# Altium schematic sheet LED fix910 RD 2000278 (4F00223A_7P00493A)_1.SchDoc
size 900 x 281 mm
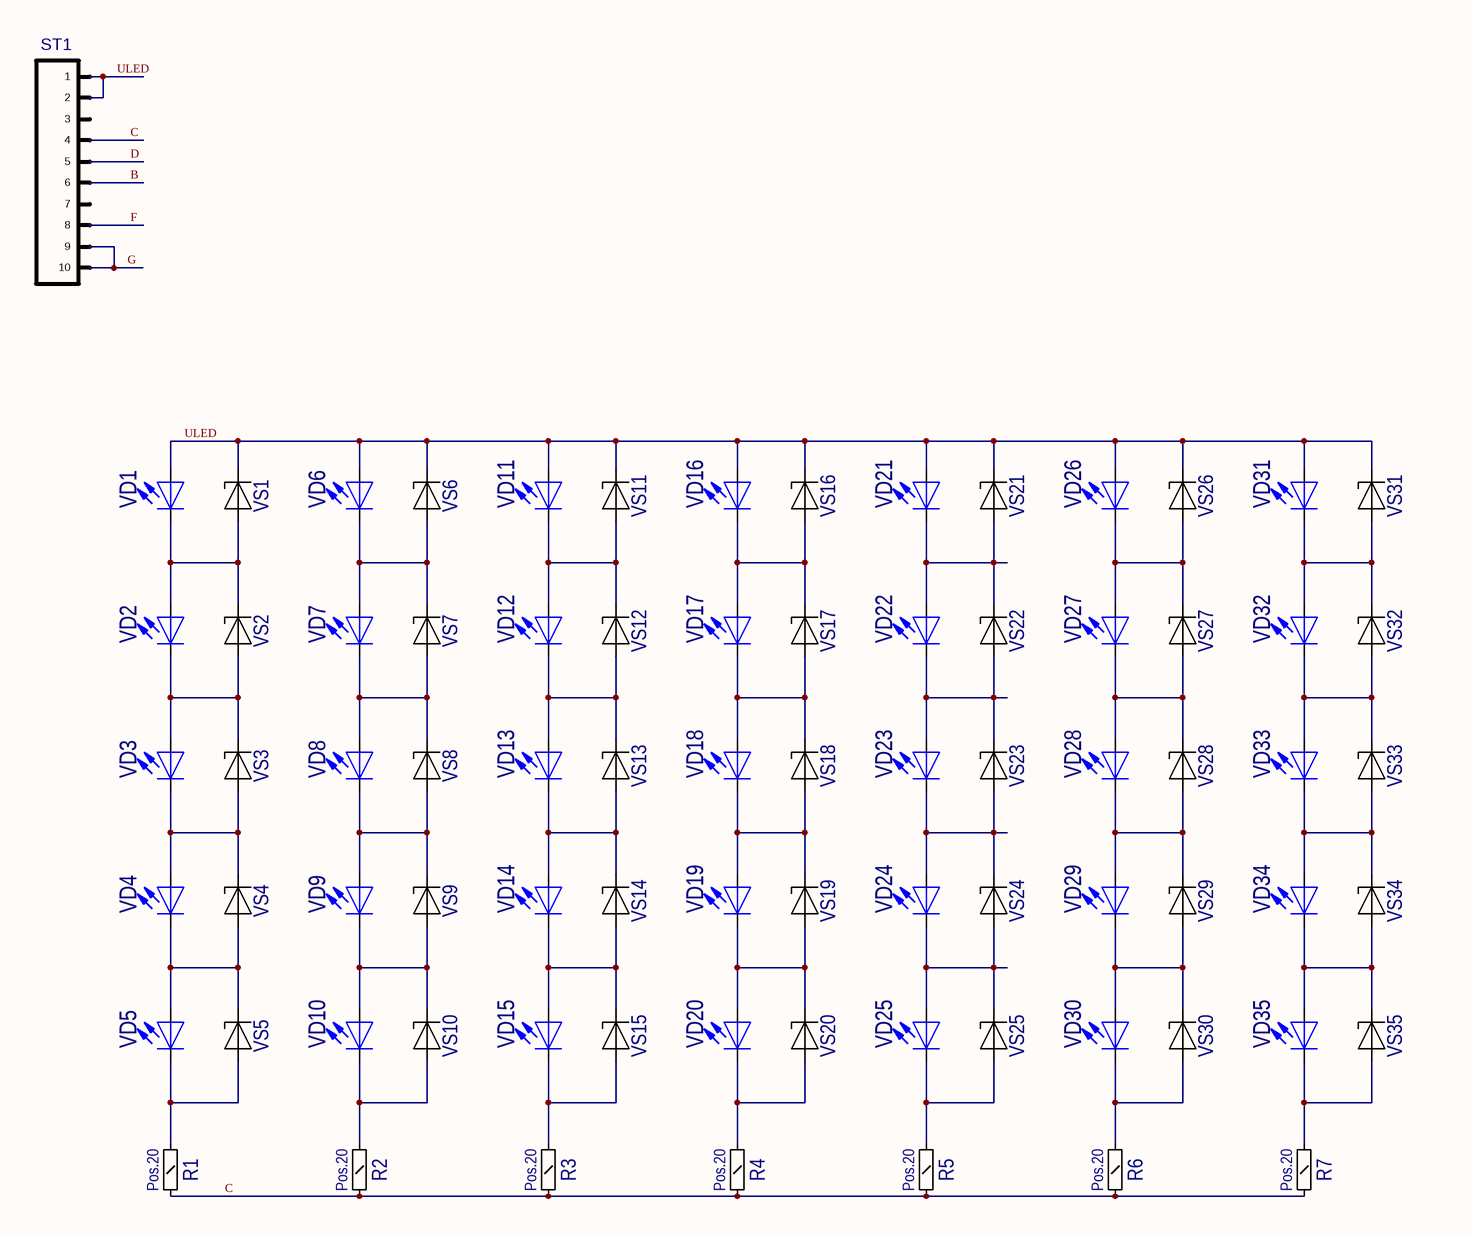
[diagram p0: LED fix910 RD 2000278 (4F00223A_7P00493A)_1.SchDoc, left]
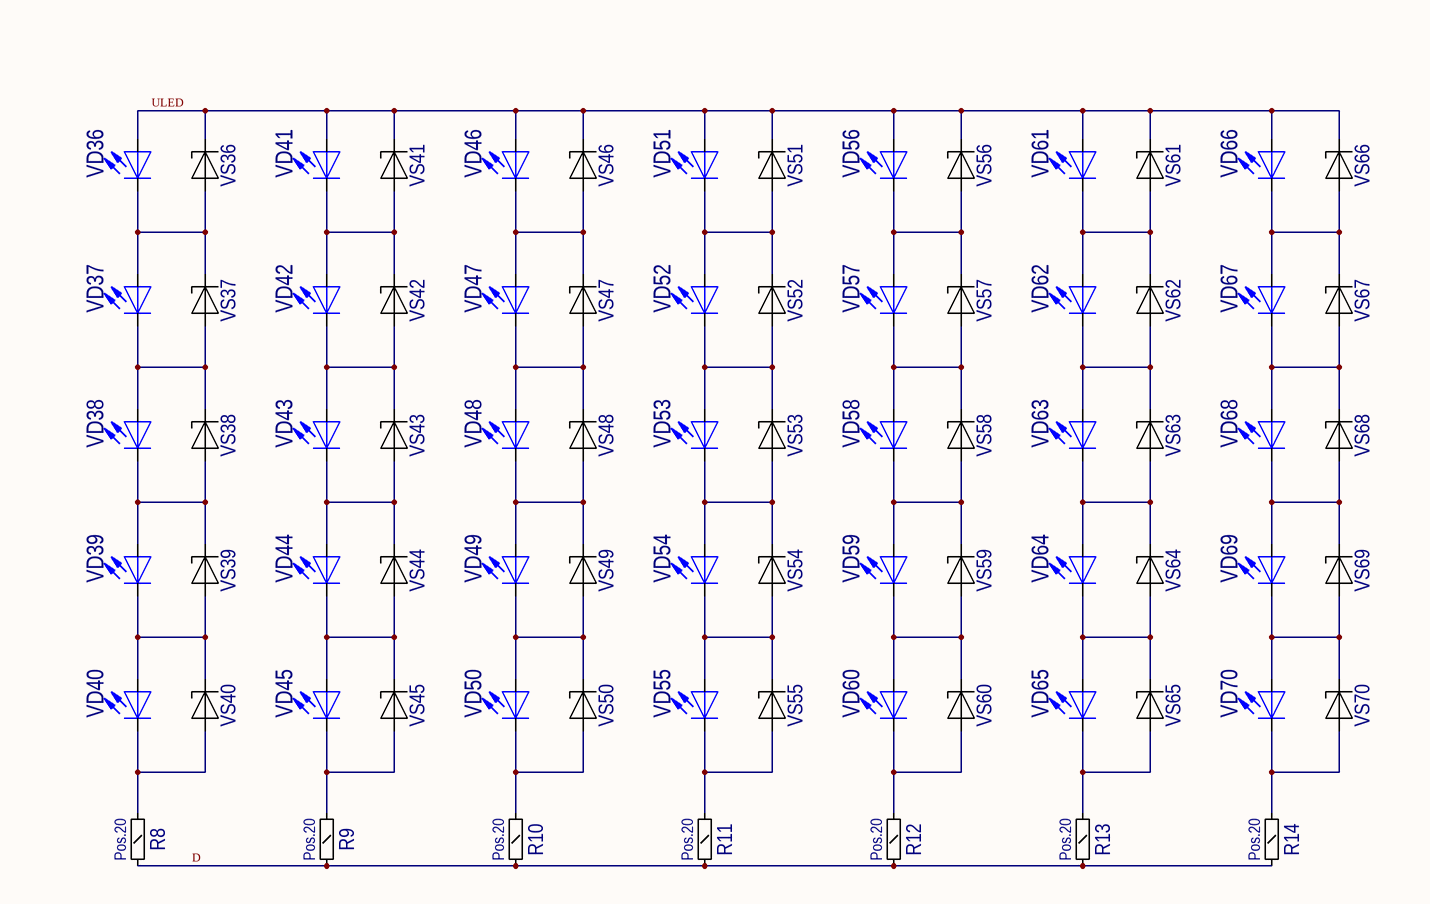
[diagram p1: LED fix910 RD 2000278 (4F00223A_7P00493A)_1.SchDoc, middle]
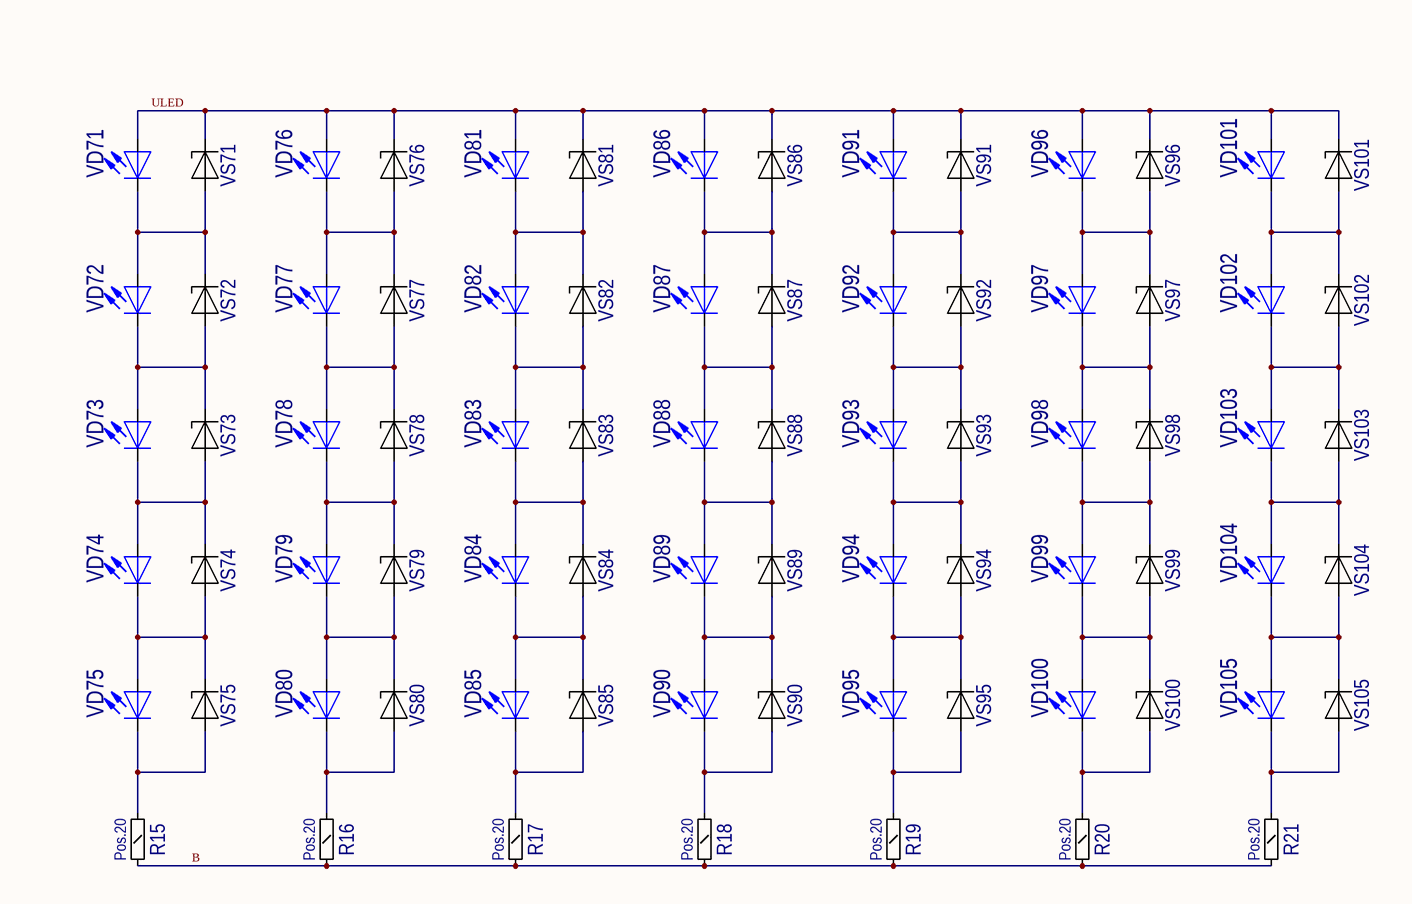
[diagram p2: LED fix910 RD 2000278 (4F00223A_7P00493A)_1.SchDoc, right]

## Parts
R1  value Pos.20  [RC1206S]  (hidden comment: R1206S)
R2  value Pos.20  [RC1206S]  (hidden comment: R1206S)
R3  value Pos.20  [RC1206S]  (hidden comment: R1206S)
R4  value Pos.20  [RC1206S]  (hidden comment: R1206S)
R5  value Pos.20  [RC1206S]  (hidden comment: R1206S)
R6  value Pos.20  [RC1206S]  (hidden comment: R1206S)
R7  value Pos.20  [RC1206S]  (hidden comment: R1206S)
R8  value Pos.20  [RC1206S]  (hidden comment: R1206S)
R9  value Pos.20  [RC1206S]  (hidden comment: R1206S)
R10  value Pos.20  [RC1206S]  (hidden comment: R1206S)
R11  value Pos.20  [RC1206S]  (hidden comment: R1206S)
R12  value Pos.20  [RC1206S]  (hidden comment: R1206S)
R13  value Pos.20  [RC1206S]  (hidden comment: R1206S)
R14  value Pos.20  [RC1206S]  (hidden comment: R1206S)
R15  value Pos.20  [RC1206S]  (hidden comment: R1206S)
R16  value Pos.20  [RC1206S]  (hidden comment: R1206S)
R17  value Pos.20  [RC1206S]  (hidden comment: R1206S)
R18  value Pos.20  [RC1206S]  (hidden comment: R1206S)
R19  value Pos.20  [RC1206S]  (hidden comment: R1206S)
R20  value Pos.20  [RC1206S]  (hidden comment: R1206S)
R21  value Pos.20  [RC1206S]  (hidden comment: R1206S)
ST1  BAND10_M  [BAND10_M]  (value not drawn)
VD1  LED, LS E65F-BBDA-1-Z, Red, OSRAM Opto Semiconductors Inc.  [E65F]  (value not drawn)
VD2  LED, LS E65F-BBDA-1-Z, Red, OSRAM Opto Semiconductors Inc.  [E65F]  (value not drawn)
VD3  LED, LS E65F-BBDA-1-Z, Red, OSRAM Opto Semiconductors Inc.  [E65F]  (value not drawn)
VD4  LED, LS E65F-BBDA-1-Z, Red, OSRAM Opto Semiconductors Inc.  [E65F]  (value not drawn)
VD5  LED, LS E65F-BBDA-1-Z, Red, OSRAM Opto Semiconductors Inc.  [E65F]  (value not drawn)
VD6  LED, LS E65F-BBDA-1-Z, Red, OSRAM Opto Semiconductors Inc.  [E65F]  (value not drawn)
VD7  LED, LS E65F-BBDA-1-Z, Red, OSRAM Opto Semiconductors Inc.  [E65F]  (value not drawn)
VD8  LED, LS E65F-BBDA-1-Z, Red, OSRAM Opto Semiconductors Inc.  [E65F]  (value not drawn)
VD9  LED, LS E65F-BBDA-1-Z, Red, OSRAM Opto Semiconductors Inc.  [E65F]  (value not drawn)
VD10  LED, LS E65F-BBDA-1-Z, Red, OSRAM Opto Semiconductors Inc.  [E65F]  (value not drawn)
VD11  LED, LS E65F-BBDA-1-Z, Red, OSRAM Opto Semiconductors Inc.  [E65F]  (value not drawn)
VD12  LED, LS E65F-BBDA-1-Z, Red, OSRAM Opto Semiconductors Inc.  [E65F]  (value not drawn)
VD13  LED, LS E65F-BBDA-1-Z, Red, OSRAM Opto Semiconductors Inc.  [E65F]  (value not drawn)
VD14  LED, LS E65F-BBDA-1-Z, Red, OSRAM Opto Semiconductors Inc.  [E65F]  (value not drawn)
VD15  LED, LS E65F-BBDA-1-Z, Red, OSRAM Opto Semiconductors Inc.  [E65F]  (value not drawn)
VD16  LED, LS E65F-BBDA-1-Z, Red, OSRAM Opto Semiconductors Inc.  [E65F]  (value not drawn)
VD17  LED, LS E65F-BBDA-1-Z, Red, OSRAM Opto Semiconductors Inc.  [E65F]  (value not drawn)
VD18  LED, LS E65F-BBDA-1-Z, Red, OSRAM Opto Semiconductors Inc.  [E65F]  (value not drawn)
VD19  LED, LS E65F-BBDA-1-Z, Red, OSRAM Opto Semiconductors Inc.  [E65F]  (value not drawn)
VD20  LED, LS E65F-BBDA-1-Z, Red, OSRAM Opto Semiconductors Inc.  [E65F]  (value not drawn)
VD21  LED, LS E65F-BBDA-1-Z, Red, OSRAM Opto Semiconductors Inc.  [E65F]  (value not drawn)
VD22  LED, LS E65F-BBDA-1-Z, Red, OSRAM Opto Semiconductors Inc.  [E65F]  (value not drawn)
VD23  LED, LS E65F-BBDA-1-Z, Red, OSRAM Opto Semiconductors Inc.  [E65F]  (value not drawn)
VD24  LED, LS E65F-BBDA-1-Z, Red, OSRAM Opto Semiconductors Inc.  [E65F]  (value not drawn)
VD25  LED, LS E65F-BBDA-1-Z, Red, OSRAM Opto Semiconductors Inc.  [E65F]  (value not drawn)
VD26  LED, LS E65F-BBDA-1-Z, Red, OSRAM Opto Semiconductors Inc.  [E65F]  (value not drawn)
VD27  LED, LS E65F-BBDA-1-Z, Red, OSRAM Opto Semiconductors Inc.  [E65F]  (value not drawn)
VD28  LED, LS E65F-BBDA-1-Z, Red, OSRAM Opto Semiconductors Inc.  [E65F]  (value not drawn)
VD29  LED, LS E65F-BBDA-1-Z, Red, OSRAM Opto Semiconductors Inc.  [E65F]  (value not drawn)
VD30  LED, LS E65F-BBDA-1-Z, Red, OSRAM Opto Semiconductors Inc.  [E65F]  (value not drawn)
VD31  LED, LS E65F-BBDA-1-Z, Red, OSRAM Opto Semiconductors Inc.  [E65F]  (value not drawn)
VD32  LED, LS E65F-BBDA-1-Z, Red, OSRAM Opto Semiconductors Inc.  [E65F]  (value not drawn)
VD33  LED, LS E65F-BBDA-1-Z, Red, OSRAM Opto Semiconductors Inc.  [E65F]  (value not drawn)
VD34  LED, LS E65F-BBDA-1-Z, Red, OSRAM Opto Semiconductors Inc.  [E65F]  (value not drawn)
VD35  LED, LS E65F-BBDA-1-Z, Red, OSRAM Opto Semiconductors Inc.  [E65F]  (value not drawn)
VD36  LED, LS E65F-BBDA-1-Z, Red, OSRAM Opto Semiconductors Inc.  [E65F]  (value not drawn)
VD37  LED, LS E65F-BBDA-1-Z, Red, OSRAM Opto Semiconductors Inc.  [E65F]  (value not drawn)
VD38  LED, LS E65F-BBDA-1-Z, Red, OSRAM Opto Semiconductors Inc.  [E65F]  (value not drawn)
VD39  LED, LS E65F-BBDA-1-Z, Red, OSRAM Opto Semiconductors Inc.  [E65F]  (value not drawn)
VD40  LED, LS E65F-BBDA-1-Z, Red, OSRAM Opto Semiconductors Inc.  [E65F]  (value not drawn)
VD41  LED, LS E65F-BBDA-1-Z, Red, OSRAM Opto Semiconductors Inc.  [E65F]  (value not drawn)
VD42  LED, LS E65F-BBDA-1-Z, Red, OSRAM Opto Semiconductors Inc.  [E65F]  (value not drawn)
VD43  LED, LS E65F-BBDA-1-Z, Red, OSRAM Opto Semiconductors Inc.  [E65F]  (value not drawn)
VD44  LED, LS E65F-BBDA-1-Z, Red, OSRAM Opto Semiconductors Inc.  [E65F]  (value not drawn)
VD45  LED, LS E65F-BBDA-1-Z, Red, OSRAM Opto Semiconductors Inc.  [E65F]  (value not drawn)
VD46  LED, LS E65F-BBDA-1-Z, Red, OSRAM Opto Semiconductors Inc.  [E65F]  (value not drawn)
VD47  LED, LS E65F-BBDA-1-Z, Red, OSRAM Opto Semiconductors Inc.  [E65F]  (value not drawn)
VD48  LED, LS E65F-BBDA-1-Z, Red, OSRAM Opto Semiconductors Inc.  [E65F]  (value not drawn)
VD49  LED, LS E65F-BBDA-1-Z, Red, OSRAM Opto Semiconductors Inc.  [E65F]  (value not drawn)
VD50  LED, LS E65F-BBDA-1-Z, Red, OSRAM Opto Semiconductors Inc.  [E65F]  (value not drawn)
VD51  LED, LS E65F-BBDA-1-Z, Red, OSRAM Opto Semiconductors Inc.  [E65F]  (value not drawn)
VD52  LED, LS E65F-BBDA-1-Z, Red, OSRAM Opto Semiconductors Inc.  [E65F]  (value not drawn)
VD53  LED, LS E65F-BBDA-1-Z, Red, OSRAM Opto Semiconductors Inc.  [E65F]  (value not drawn)
VD54  LED, LS E65F-BBDA-1-Z, Red, OSRAM Opto Semiconductors Inc.  [E65F]  (value not drawn)
VD55  LED, LS E65F-BBDA-1-Z, Red, OSRAM Opto Semiconductors Inc.  [E65F]  (value not drawn)
VD56  LED, LS E65F-BBDA-1-Z, Red, OSRAM Opto Semiconductors Inc.  [E65F]  (value not drawn)
VD57  LED, LS E65F-BBDA-1-Z, Red, OSRAM Opto Semiconductors Inc.  [E65F]  (value not drawn)
VD58  LED, LS E65F-BBDA-1-Z, Red, OSRAM Opto Semiconductors Inc.  [E65F]  (value not drawn)
VD59  LED, LS E65F-BBDA-1-Z, Red, OSRAM Opto Semiconductors Inc.  [E65F]  (value not drawn)
VD60  LED, LS E65F-BBDA-1-Z, Red, OSRAM Opto Semiconductors Inc.  [E65F]  (value not drawn)
VD61  LED, LS E65F-BBDA-1-Z, Red, OSRAM Opto Semiconductors Inc.  [E65F]  (value not drawn)
VD62  LED, LS E65F-BBDA-1-Z, Red, OSRAM Opto Semiconductors Inc.  [E65F]  (value not drawn)
VD63  LED, LS E65F-BBDA-1-Z, Red, OSRAM Opto Semiconductors Inc.  [E65F]  (value not drawn)
VD64  LED, LS E65F-BBDA-1-Z, Red, OSRAM Opto Semiconductors Inc.  [E65F]  (value not drawn)
VD65  LED, LS E65F-BBDA-1-Z, Red, OSRAM Opto Semiconductors Inc.  [E65F]  (value not drawn)
VD66  LED, LS E65F-BBDA-1-Z, Red, OSRAM Opto Semiconductors Inc.  [E65F]  (value not drawn)
VD67  LED, LS E65F-BBDA-1-Z, Red, OSRAM Opto Semiconductors Inc.  [E65F]  (value not drawn)
VD68  LED, LS E65F-BBDA-1-Z, Red, OSRAM Opto Semiconductors Inc.  [E65F]  (value not drawn)
VD69  LED, LS E65F-BBDA-1-Z, Red, OSRAM Opto Semiconductors Inc.  [E65F]  (value not drawn)
VD70  LED, LS E65F-BBDA-1-Z, Red, OSRAM Opto Semiconductors Inc.  [E65F]  (value not drawn)
VD71  LED, LS E65F-BBDA-1-Z, Red, OSRAM Opto Semiconductors Inc.  [E65F]  (value not drawn)
VD72  LED, LS E65F-BBDA-1-Z, Red, OSRAM Opto Semiconductors Inc.  [E65F]  (value not drawn)
VD73  LED, LS E65F-BBDA-1-Z, Red, OSRAM Opto Semiconductors Inc.  [E65F]  (value not drawn)
VD74  LED, LS E65F-BBDA-1-Z, Red, OSRAM Opto Semiconductors Inc.  [E65F]  (value not drawn)
VD75  LED, LS E65F-BBDA-1-Z, Red, OSRAM Opto Semiconductors Inc.  [E65F]  (value not drawn)
VD76  LED, LS E65F-BBDA-1-Z, Red, OSRAM Opto Semiconductors Inc.  [E65F]  (value not drawn)
VD77  LED, LS E65F-BBDA-1-Z, Red, OSRAM Opto Semiconductors Inc.  [E65F]  (value not drawn)
VD78  LED, LS E65F-BBDA-1-Z, Red, OSRAM Opto Semiconductors Inc.  [E65F]  (value not drawn)
VD79  LED, LS E65F-BBDA-1-Z, Red, OSRAM Opto Semiconductors Inc.  [E65F]  (value not drawn)
VD80  LED, LS E65F-BBDA-1-Z, Red, OSRAM Opto Semiconductors Inc.  [E65F]  (value not drawn)
VD81  LED, LS E65F-BBDA-1-Z, Red, OSRAM Opto Semiconductors Inc.  [E65F]  (value not drawn)
VD82  LED, LS E65F-BBDA-1-Z, Red, OSRAM Opto Semiconductors Inc.  [E65F]  (value not drawn)
VD83  LED, LS E65F-BBDA-1-Z, Red, OSRAM Opto Semiconductors Inc.  [E65F]  (value not drawn)
VD84  LED, LS E65F-BBDA-1-Z, Red, OSRAM Opto Semiconductors Inc.  [E65F]  (value not drawn)
VD85  LED, LS E65F-BBDA-1-Z, Red, OSRAM Opto Semiconductors Inc.  [E65F]  (value not drawn)
VD86  LED, LS E65F-BBDA-1-Z, Red, OSRAM Opto Semiconductors Inc.  [E65F]  (value not drawn)
VD87  LED, LS E65F-BBDA-1-Z, Red, OSRAM Opto Semiconductors Inc.  [E65F]  (value not drawn)
VD88  LED, LS E65F-BBDA-1-Z, Red, OSRAM Opto Semiconductors Inc.  [E65F]  (value not drawn)
VD89  LED, LS E65F-BBDA-1-Z, Red, OSRAM Opto Semiconductors Inc.  [E65F]  (value not drawn)
VD90  LED, LS E65F-BBDA-1-Z, Red, OSRAM Opto Semiconductors Inc.  [E65F]  (value not drawn)
VD91  LED, LS E65F-BBDA-1-Z, Red, OSRAM Opto Semiconductors Inc.  [E65F]  (value not drawn)
VD92  LED, LS E65F-BBDA-1-Z, Red, OSRAM Opto Semiconductors Inc.  [E65F]  (value not drawn)
VD93  LED, LS E65F-BBDA-1-Z, Red, OSRAM Opto Semiconductors Inc.  [E65F]  (value not drawn)
VD94  LED, LS E65F-BBDA-1-Z, Red, OSRAM Opto Semiconductors Inc.  [E65F]  (value not drawn)
VD95  LED, LS E65F-BBDA-1-Z, Red, OSRAM Opto Semiconductors Inc.  [E65F]  (value not drawn)
VD96  LED, LS E65F-BBDA-1-Z, Red, OSRAM Opto Semiconductors Inc.  [E65F]  (value not drawn)
VD97  LED, LS E65F-BBDA-1-Z, Red, OSRAM Opto Semiconductors Inc.  [E65F]  (value not drawn)
VD98  LED, LS E65F-BBDA-1-Z, Red, OSRAM Opto Semiconductors Inc.  [E65F]  (value not drawn)
VD99  LED, LS E65F-BBDA-1-Z, Red, OSRAM Opto Semiconductors Inc.  [E65F]  (value not drawn)
VD100  LED, LS E65F-BBDA-1-Z, Red, OSRAM Opto Semiconductors Inc.  [E65F]  (value not drawn)
VD101  LED, LS E65F-BBDA-1-Z, Red, OSRAM Opto Semiconductors Inc.  [E65F]  (value not drawn)
VD102  LED, LS E65F-BBDA-1-Z, Red, OSRAM Opto Semiconductors Inc.  [E65F]  (value not drawn)
VD103  LED, LS E65F-BBDA-1-Z, Red, OSRAM Opto Semiconductors Inc.  [E65F]  (value not drawn)
VD104  LED, LS E65F-BBDA-1-Z, Red, OSRAM Opto Semiconductors Inc.  [E65F]  (value not drawn)
VD105  LED, LS E65F-BBDA-1-Z, Red, OSRAM Opto Semiconductors Inc.  [E65F]  (value not drawn)
VS1  BZX84  [SOT23]  (value not drawn)
VS2  BZX84  [SOT23]  (value not drawn)
VS3  BZX84  [SOT23]  (value not drawn)
VS4  BZX84  [SOT23]  (value not drawn)
VS5  BZX84  [SOT23]  (value not drawn)
VS6  BZX84  [SOT23]  (value not drawn)
VS7  BZX84  [SOT23]  (value not drawn)
VS8  BZX84  [SOT23]  (value not drawn)
VS9  BZX84  [SOT23]  (value not drawn)
VS10  BZX84  [SOT23]  (value not drawn)
VS11  BZX84  [SOT23]  (value not drawn)
VS12  BZX84  [SOT23]  (value not drawn)
VS13  BZX84  [SOT23]  (value not drawn)
VS14  BZX84  [SOT23]  (value not drawn)
VS15  BZX84  [SOT23]  (value not drawn)
VS16  BZX84  [SOT23]  (value not drawn)
VS17  BZX84  [SOT23]  (value not drawn)
VS18  BZX84  [SOT23]  (value not drawn)
VS19  BZX84  [SOT23]  (value not drawn)
VS20  BZX84  [SOT23]  (value not drawn)
VS21  BZX84  [SOT23]  (value not drawn)
VS22  BZX84  [SOT23]  (value not drawn)
VS23  BZX84  [SOT23]  (value not drawn)
VS24  BZX84  [SOT23]  (value not drawn)
VS25  BZX84  [SOT23]  (value not drawn)
VS26  BZX84  [SOT23]  (value not drawn)
VS27  BZX84  [SOT23]  (value not drawn)
VS28  BZX84  [SOT23]  (value not drawn)
VS29  BZX84  [SOT23]  (value not drawn)
VS30  BZX84  [SOT23]  (value not drawn)
VS31  BZX84  [SOT23]  (value not drawn)
VS32  BZX84  [SOT23]  (value not drawn)
VS33  BZX84  [SOT23]  (value not drawn)
VS34  BZX84  [SOT23]  (value not drawn)
VS35  BZX84  [SOT23]  (value not drawn)
VS36  BZX84  [SOT23]  (value not drawn)
VS37  BZX84  [SOT23]  (value not drawn)
VS38  BZX84  [SOT23]  (value not drawn)
VS39  BZX84  [SOT23]  (value not drawn)
VS40  BZX84  [SOT23]  (value not drawn)
VS41  BZX84  [SOT23]  (value not drawn)
VS42  BZX84  [SOT23]  (value not drawn)
VS43  BZX84  [SOT23]  (value not drawn)
VS44  BZX84  [SOT23]  (value not drawn)
VS45  BZX84  [SOT23]  (value not drawn)
VS46  BZX84  [SOT23]  (value not drawn)
VS47  BZX84  [SOT23]  (value not drawn)
VS48  BZX84  [SOT23]  (value not drawn)
VS49  BZX84  [SOT23]  (value not drawn)
VS50  BZX84  [SOT23]  (value not drawn)
VS51  BZX84  [SOT23]  (value not drawn)
VS52  BZX84  [SOT23]  (value not drawn)
VS53  BZX84  [SOT23]  (value not drawn)
VS54  BZX84  [SOT23]  (value not drawn)
VS55  BZX84  [SOT23]  (value not drawn)
VS56  BZX84  [SOT23]  (value not drawn)
VS57  BZX84  [SOT23]  (value not drawn)
VS58  BZX84  [SOT23]  (value not drawn)
VS59  BZX84  [SOT23]  (value not drawn)
VS60  BZX84  [SOT23]  (value not drawn)
VS61  BZX84  [SOT23]  (value not drawn)
VS62  BZX84  [SOT23]  (value not drawn)
VS63  BZX84  [SOT23]  (value not drawn)
VS64  BZX84  [SOT23]  (value not drawn)
VS65  BZX84  [SOT23]  (value not drawn)
VS66  BZX84  [SOT23]  (value not drawn)
VS67  BZX84  [SOT23]  (value not drawn)
VS68  BZX84  [SOT23]  (value not drawn)
VS69  BZX84  [SOT23]  (value not drawn)
VS70  BZX84  [SOT23]  (value not drawn)
VS71  BZX84  [SOT23]  (value not drawn)
VS72  BZX84  [SOT23]  (value not drawn)
VS73  BZX84  [SOT23]  (value not drawn)
VS74  BZX84  [SOT23]  (value not drawn)
VS75  BZX84  [SOT23]  (value not drawn)
VS76  BZX84  [SOT23]  (value not drawn)
VS77  BZX84  [SOT23]  (value not drawn)
VS78  BZX84  [SOT23]  (value not drawn)
VS79  BZX84  [SOT23]  (value not drawn)
VS80  BZX84  [SOT23]  (value not drawn)
VS81  BZX84  [SOT23]  (value not drawn)
VS82  BZX84  [SOT23]  (value not drawn)
VS83  BZX84  [SOT23]  (value not drawn)
VS84  BZX84  [SOT23]  (value not drawn)
VS85  BZX84  [SOT23]  (value not drawn)
VS86  BZX84  [SOT23]  (value not drawn)
VS87  BZX84  [SOT23]  (value not drawn)
VS88  BZX84  [SOT23]  (value not drawn)
VS89  BZX84  [SOT23]  (value not drawn)
VS90  BZX84  [SOT23]  (value not drawn)
VS91  BZX84  [SOT23]  (value not drawn)
VS92  BZX84  [SOT23]  (value not drawn)
VS93  BZX84  [SOT23]  (value not drawn)
VS94  BZX84  [SOT23]  (value not drawn)
VS95  BZX84  [SOT23]  (value not drawn)
VS96  BZX84  [SOT23]  (value not drawn)
VS97  BZX84  [SOT23]  (value not drawn)
VS98  BZX84  [SOT23]  (value not drawn)
VS99  BZX84  [SOT23]  (value not drawn)
VS100  BZX84  [SOT23]  (value not drawn)
VS101  BZX84  [SOT23]  (value not drawn)
VS102  BZX84  [SOT23]  (value not drawn)
VS103  BZX84  [SOT23]  (value not drawn)
VS104  BZX84  [SOT23]  (value not drawn)
VS105  BZX84  [SOT23]  (value not drawn)

## Nets
B: R15.2 R16.2 R17.2 R18.2 R19.2 R20.2 R21.2 ST1.6
C: R1.2 R2.2 R3.2 R4.2 R5.2 R6.2 R7.2 ST1.4
D: R8.2 R9.2 R10.2 R11.2 R12.2 R13.2 R14.2 ST1.5
F: ST1.8
G: ST1.9 ST1.10
ULED: ST1.1 ST1.2 VD1.2(A) VD6.2(A) VD11.2(A) VD16.2(A) VD21.2(A) VD26.2(A) VD31.2(A) VD36.2(A) VD41.2(A) VD46.2(A) VD51.2(A) VD56.2(A) VD61.2(A) VD66.2(A) VD71.2(A) VD76.2(A) VD81.2(A) VD86.2(A) VD91.2(A) VD96.2(A) VD101.2(A) VS1.3 VS6.3 VS11.3 VS16.3 VS21.3 VS26.3 VS31.3 VS36.3 VS41.3 VS46.3 VS51.3 VS56.3 VS61.3 VS66.3 VS71.3 VS76.3 VS81.3 VS86.3 VS91.3 VS96.3 VS101.3
NetR1_1: R1.1 VD5.1(K) VS5.1
NetR2_1: R2.1 VD10.1(K) VS10.1
NetR3_1: R3.1 VD15.1(K) VS15.1
NetR4_1: R4.1 VD20.1(K) VS20.1
NetR5_1: R5.1 VD25.1(K) VS25.1
NetR6_1: R6.1 VD30.1(K) VS30.1
NetR7_1: R7.1 VD35.1(K) VS35.1
NetR8_1: R8.1 VD40.1(K) VS40.1
NetR9_1: R9.1 VD45.1(K) VS45.1
NetR10_1: R10.1 VD50.1(K) VS50.1
NetR11_1: R11.1 VD55.1(K) VS55.1
NetR12_1: R12.1 VD60.1(K) VS60.1
NetR13_1: R13.1 VD65.1(K) VS65.1
NetR14_1: R14.1 VD70.1(K) VS70.1
NetR15_1: R15.1 VD75.1(K) VS75.1
NetR16_1: R16.1 VD80.1(K) VS80.1
NetR17_1: R17.1 VD85.1(K) VS85.1
NetR18_1: R18.1 VD90.1(K) VS90.1
NetR19_1: R19.1 VD95.1(K) VS95.1
NetR20_1: R20.1 VD100.1(K) VS100.1
NetR21_1: R21.1 VD105.1(K) VS105.1
NetVD1_1: VD1.1(K) VD2.2(A) VS1.1 VS2.3
NetVD2_1: VD2.1(K) VD3.2(A) VS2.1 VS3.3
NetVD3_1: VD3.1(K) VD4.2(A) VS3.1 VS4.3
NetVD4_1: VD4.1(K) VD5.2(A) VS4.1 VS5.3
NetVD6_1: VD6.1(K) VD7.2(A) VS6.1 VS7.3
NetVD7_1: VD7.1(K) VD8.2(A) VS7.1 VS8.3
NetVD8_1: VD8.1(K) VD9.2(A) VS8.1 VS9.3
NetVD9_1: VD9.1(K) VD10.2(A) VS9.1 VS10.3
NetVD11_1: VD11.1(K) VD12.2(A) VS11.1 VS12.3
NetVD12_1: VD12.1(K) VD13.2(A) VS12.1 VS13.3
NetVD13_1: VD13.1(K) VD14.2(A) VS13.1 VS14.3
NetVD14_1: VD14.1(K) VD15.2(A) VS14.1 VS15.3
NetVD16_1: VD16.1(K) VD17.2(A) VS16.1 VS17.3
NetVD17_1: VD17.1(K) VD18.2(A) VS17.1 VS18.3
NetVD18_1: VD18.1(K) VD19.2(A) VS18.1 VS19.3
NetVD19_1: VD19.1(K) VD20.2(A) VS19.1 VS20.3
NetVD21_1: VD21.1(K) VD22.2(A) VS21.1 VS22.3
NetVD22_1: VD22.1(K) VD23.2(A) VS22.1 VS23.3
NetVD23_1: VD23.1(K) VD24.2(A) VS23.1 VS24.3
NetVD24_1: VD24.1(K) VD25.2(A) VS24.1 VS25.3
NetVD26_1: VD26.1(K) VD27.2(A) VS26.1 VS27.3
NetVD27_1: VD27.1(K) VD28.2(A) VS27.1 VS28.3
NetVD28_1: VD28.1(K) VD29.2(A) VS28.1 VS29.3
NetVD29_1: VD29.1(K) VD30.2(A) VS29.1 VS30.3
NetVD31_1: VD31.1(K) VD32.2(A) VS31.1 VS32.3
NetVD32_1: VD32.1(K) VD33.2(A) VS32.1 VS33.3
NetVD33_1: VD33.1(K) VD34.2(A) VS33.1 VS34.3
NetVD34_1: VD34.1(K) VD35.2(A) VS34.1 VS35.3
NetVD36_1: VD36.1(K) VD37.2(A) VS36.1 VS37.3
NetVD37_1: VD37.1(K) VD38.2(A) VS37.1 VS38.3
NetVD38_1: VD38.1(K) VD39.2(A) VS38.1 VS39.3
NetVD39_1: VD39.1(K) VD40.2(A) VS39.1 VS40.3
NetVD41_1: VD41.1(K) VD42.2(A) VS41.1 VS42.3
NetVD42_1: VD42.1(K) VD43.2(A) VS42.1 VS43.3
NetVD43_1: VD43.1(K) VD44.2(A) VS43.1 VS44.3
NetVD44_1: VD44.1(K) VD45.2(A) VS44.1 VS45.3
NetVD46_1: VD46.1(K) VD47.2(A) VS46.1 VS47.3
NetVD47_1: VD47.1(K) VD48.2(A) VS47.1 VS48.3
NetVD48_1: VD48.1(K) VD49.2(A) VS48.1 VS49.3
NetVD49_1: VD49.1(K) VD50.2(A) VS49.1 VS50.3
NetVD51_1: VD51.1(K) VD52.2(A) VS51.1 VS52.3
NetVD52_1: VD52.1(K) VD53.2(A) VS52.1 VS53.3
NetVD53_1: VD53.1(K) VD54.2(A) VS53.1 VS54.3
NetVD54_1: VD54.1(K) VD55.2(A) VS54.1 VS55.3
NetVD56_1: VD56.1(K) VD57.2(A) VS56.1 VS57.3
NetVD57_1: VD57.1(K) VD58.2(A) VS57.1 VS58.3
NetVD58_1: VD58.1(K) VD59.2(A) VS58.1 VS59.3
NetVD59_1: VD59.1(K) VD60.2(A) VS59.1 VS60.3
NetVD61_1: VD61.1(K) VD62.2(A) VS61.1 VS62.3
NetVD62_1: VD62.1(K) VD63.2(A) VS62.1 VS63.3
NetVD63_1: VD63.1(K) VD64.2(A) VS63.1 VS64.3
NetVD64_1: VD64.1(K) VD65.2(A) VS64.1 VS65.3
NetVD66_1: VD66.1(K) VD67.2(A) VS66.1 VS67.3
NetVD67_1: VD67.1(K) VD68.2(A) VS67.1 VS68.3
NetVD68_1: VD68.1(K) VD69.2(A) VS68.1 VS69.3
NetVD69_1: VD69.1(K) VD70.2(A) VS69.1 VS70.3
NetVD71_1: VD71.1(K) VD72.2(A) VS71.1 VS72.3
NetVD72_1: VD72.1(K) VD73.2(A) VS72.1 VS73.3
NetVD73_1: VD73.1(K) VD74.2(A) VS73.1 VS74.3
NetVD74_1: VD74.1(K) VD75.2(A) VS74.1 VS75.3
NetVD76_1: VD76.1(K) VD77.2(A) VS76.1 VS77.3
NetVD77_1: VD77.1(K) VD78.2(A) VS77.1 VS78.3
NetVD78_1: VD78.1(K) VD79.2(A) VS78.1 VS79.3
NetVD79_1: VD79.1(K) VD80.2(A) VS79.1 VS80.3
NetVD81_1: VD81.1(K) VD82.2(A) VS81.1 VS82.3
NetVD82_1: VD82.1(K) VD83.2(A) VS82.1 VS83.3
NetVD83_1: VD83.1(K) VD84.2(A) VS83.1 VS84.3
NetVD84_1: VD84.1(K) VD85.2(A) VS84.1 VS85.3
NetVD86_1: VD86.1(K) VD87.2(A) VS86.1 VS87.3
NetVD87_1: VD87.1(K) VD88.2(A) VS87.1 VS88.3
NetVD88_1: VD88.1(K) VD89.2(A) VS88.1 VS89.3
NetVD89_1: VD89.1(K) VD90.2(A) VS89.1 VS90.3
NetVD91_1: VD91.1(K) VD92.2(A) VS91.1 VS92.3
NetVD92_1: VD92.1(K) VD93.2(A) VS92.1 VS93.3
NetVD93_1: VD93.1(K) VD94.2(A) VS93.1 VS94.3
NetVD94_1: VD94.1(K) VD95.2(A) VS94.1 VS95.3
NetVD96_1: VD96.1(K) VD97.2(A) VS96.1 VS97.3
NetVD97_1: VD97.1(K) VD98.2(A) VS97.1 VS98.3
NetVD98_1: VD98.1(K) VD99.2(A) VS98.1 VS99.3
NetVD99_1: VD99.1(K) VD100.2(A) VS99.1 VS100.3
NetVD101_1: VD101.1(K) VD102.2(A) VS101.1 VS102.3
NetVD102_1: VD102.1(K) VD103.2(A) VS102.1 VS103.3
NetVD103_1: VD103.1(K) VD104.2(A) VS103.1 VS104.3
NetVD104_1: VD104.1(K) VD105.2(A) VS104.1 VS105.3

Not connected (* = marked no-connect by the designer): ST1 3 7 11 12 13 14 15 16 17 18 19 20; VS1 2; VS2 2; VS3 2; VS4 2; VS5 2; VS6 2; VS7 2; VS8 2; VS9 2; VS10 2; VS11 2; VS12 2; VS13 2; VS14 2; VS15 2; VS16 2; VS17 2; VS18 2; VS19 2; VS20 2; VS21 2; VS22 2; VS23 2; VS24 2; VS25 2; VS26 2; VS27 2; VS28 2; VS29 2; VS30 2; VS31 2; VS32 2; VS33 2; VS34 2; VS35 2; VS36 2; VS37 2; VS38 2; VS39 2; VS40 2; VS41 2; VS42 2; VS43 2; VS44 2; VS45 2; VS46 2; VS47 2; VS48 2; VS49 2; VS50 2; VS51 2; VS52 2; VS53 2; VS54 2; VS55 2; VS56 2; VS57 2; VS58 2; VS59 2; VS60 2; VS61 2; VS62 2; VS63 2; VS64 2; VS65 2; VS66 2; VS67 2; VS68 2; VS69 2; VS70 2; VS71 2; VS72 2; VS73 2; VS74 2; VS75 2; VS76 2; VS77 2; VS78 2; VS79 2; VS80 2; VS81 2; VS82 2; VS83 2; VS84 2; VS85 2; VS86 2; VS87 2; VS88 2; VS89 2; VS90 2; VS91 2; VS92 2; VS93 2; VS94 2; VS95 2; VS96 2; VS97 2; VS98 2; VS99 2; VS100 2; VS101 2; VS102 2; VS103 2; VS104 2; VS105 2

## Library data of the parts
VD1-VD105 = 4176: idComponent: 4176; Jofre_PN: HL1032; Component_Group: Diodes; Tech_Specification: LED Chip, LS E65F-BBDA-1-Z, Red, 633nm, 3920mcd, 60 deg, 2,15V, 50 mA, -40°C...+85°C, PLCC-4, OSRAM Opto Semiconductors Inc.; Mounting_Type: SMD; Operating_Temperature: -40°C...+85°C; Notes: price Digi-Key @2.000; User: ke-sta@kd-sta; Value: LS E65F-BBDA-1-Z; Component_Type: LED; Package: PLCC-4; Marking_Code: -; Manufacturer: OSRAM Opto Semiconductors Inc.; Manufacturer_PN: LS E65F-BBDA-1-Z; ComponentLink1Description: Datasheet; ComponentLink1URL: https://media.digikey.com/pdf/Data%20Sheets/Osram%20PDFs/LS_E65F_Rev1.2.pdf; Price_EUR: 0,15835; Status: Unchecked; Date_of_Update: 12.11.2018 13:55:11; Date_of_Creation: 30.10.2018 19:15:38
VS1-VS105 = BZX84: OriginalName: DIODE; Value: *
ST1 = BAND10_M: ModifyDate: 07/10/2006 11:23:08